# Altium schematic sheet CoverSchematic.SchDoc
size 431 x 279 mm; SheetNumber: 1; SheetTotal: 8
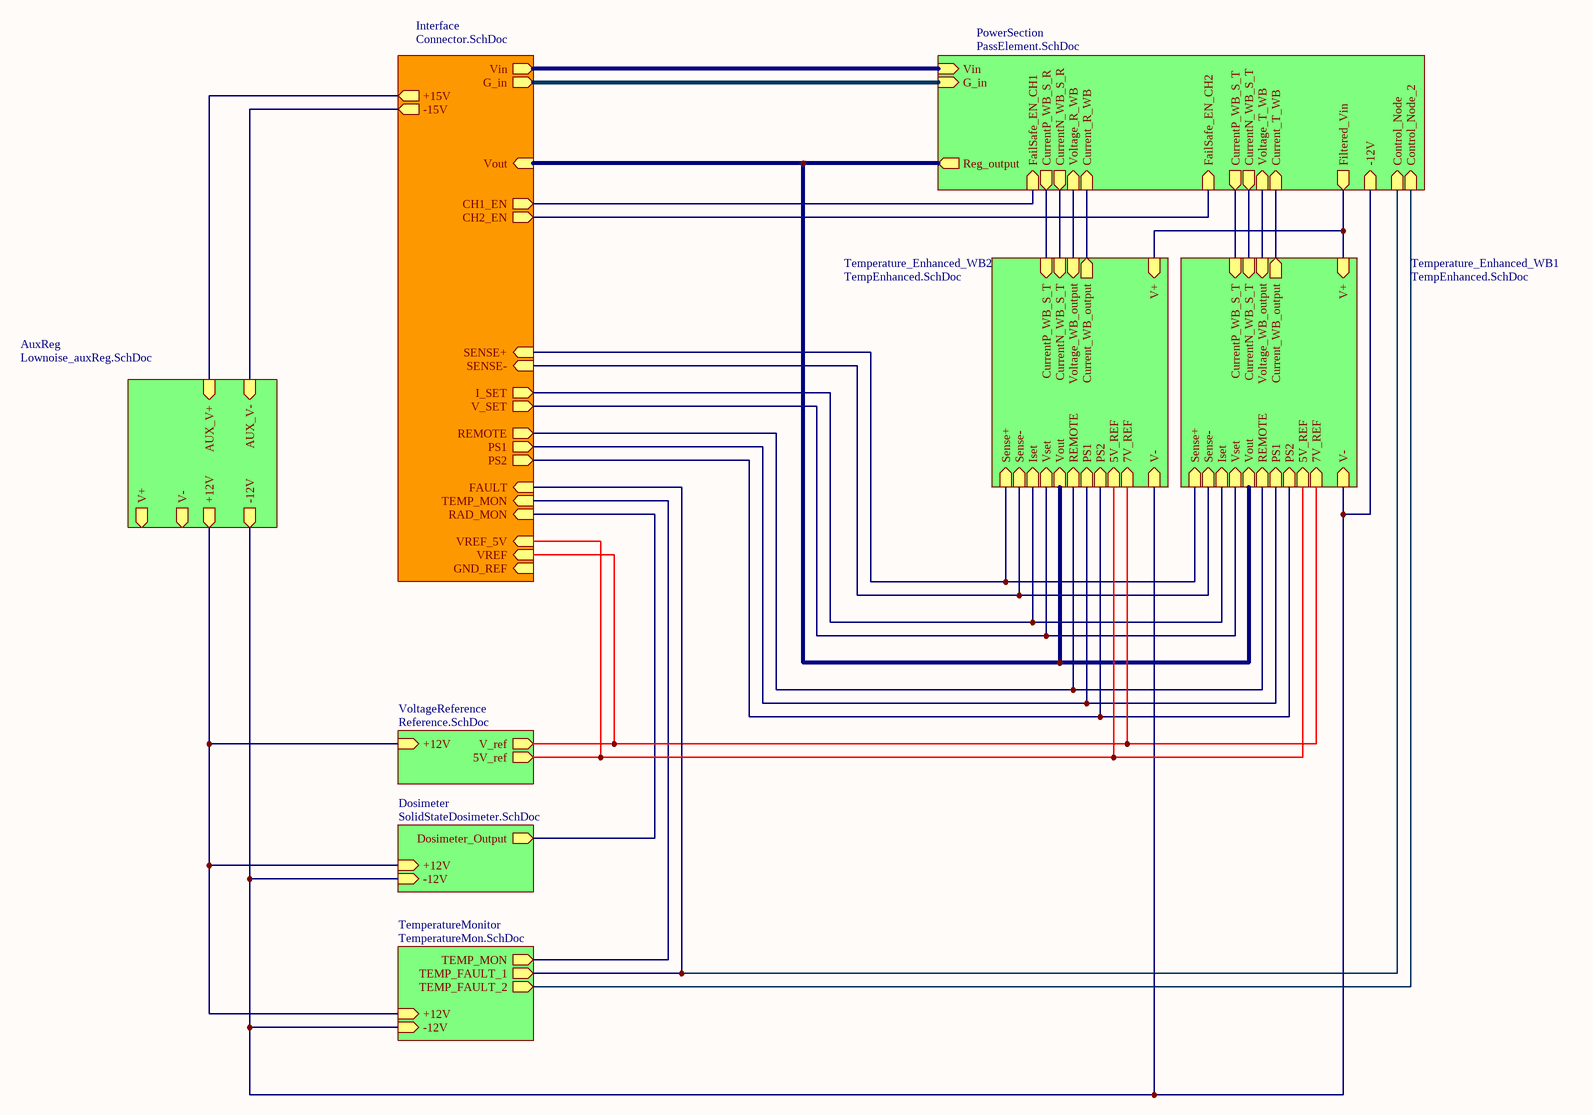
[diagram p0: CoverSchematic.SchDoc]

## Sub-sheets
AuxReg = Lownoise_auxReg.SchDoc: AUX_V+ (in), AUX_V- (in), +12V (out), -12V (out), V+ (out), V- (out)
Dosimeter = SolidStateDosimeter.SchDoc: Dosimeter_Output (out), -12V (in), +12V (in)
Interface = Connector.SchDoc: Vin (out), +15V (out), -15V (out), SENSE- (in), SENSE+ (in), Vout (in), V_SET (out), I_SET (out), CH1_EN (out), CH2_EN (out), FAULT (in), RAD_MON (in), TEMP_MON (in), VREF_5V (in), GND_REF (in), VREF (in), PS2 (out), REMOTE (out), PS1 (out), G_in (out)
PowerSection = PassElement.SchDoc: Vin (in), Reg_output (out), -12V (in), FailSafe_EN_CH1 (in), CurrentP_WB_S_R (out), CurrentN_WB_S_R (out), Voltage_R_WB (in), Current_R_WB (in), FailSafe_EN_CH2 (in), CurrentP_WB_S_T (out), CurrentN_WB_S_T (out), Voltage_T_WB (in), Current_T_WB (in), Filtered_Vin (out), Control_Node (in), Control_Node_2 (in), G_in (in)
Temperature_Enhanced_WB1 = TempEnhanced.SchDoc: V+ (in), V- (in), Voltage_WB_output (in), Current_WB_output (out), CurrentP_WB_S_T (in), CurrentN_WB_S_T (in), Sense+ (in), Sense- (in), Iset (in), Vset (in), 5V_REF (in), 7V_REF (in), Vout (in), REMOTE (in), PS1 (in), PS2 (in)
Temperature_Enhanced_WB2 = TempEnhanced.SchDoc: V+ (in), V- (in), Voltage_WB_output (in), Current_WB_output (out), CurrentP_WB_S_T (in), CurrentN_WB_S_T (in), Sense+ (in), Sense- (in), Iset (in), Vset (in), 5V_REF (in), 7V_REF (in), Vout (in), REMOTE (in), PS1 (in), PS2 (in)
TemperatureMonitor = TemperatureMon.SchDoc: -12V (in), +12V (in), TEMP_FAULT_1 (out), TEMP_MON (out), TEMP_FAULT_2 (out)
VoltageReference = Reference.SchDoc: V_ref (out), 5V_ref (out), +12V (in)

## Nets
(unnamed): sheet Interface/Vin, sheet PowerSection/Vin
(unnamed): sheet Interface/+15V, sheet AuxReg/AUX_V+
(unnamed): sheet Interface/-15V, sheet AuxReg/AUX_V-
(unnamed): sheet Interface/SENSE-, sheet Temperature_Enhanced_WB1/Sense-, sheet Temperature_Enhanced_WB2/Sense-
(unnamed): sheet Interface/SENSE+, sheet Temperature_Enhanced_WB1/Sense+, sheet Temperature_Enhanced_WB2/Sense+
(unnamed): sheet Interface/Vout, sheet PowerSection/Reg_output, sheet Temperature_Enhanced_WB1/Vout, sheet Temperature_Enhanced_WB2/Vout
(unnamed): sheet Interface/V_SET, sheet Temperature_Enhanced_WB1/Vset, sheet Temperature_Enhanced_WB2/Vset
(unnamed): sheet Interface/I_SET, sheet Temperature_Enhanced_WB1/Iset, sheet Temperature_Enhanced_WB2/Iset
(unnamed): sheet Interface/CH1_EN, sheet PowerSection/FailSafe_EN_CH1
(unnamed): sheet Interface/CH2_EN, sheet PowerSection/FailSafe_EN_CH2
(unnamed): sheet Interface/FAULT, sheet PowerSection/Control_Node, sheet TemperatureMonitor/TEMP_FAULT_1
(unnamed): sheet Interface/RAD_MON, sheet Dosimeter/Dosimeter_Output
(unnamed): sheet Interface/TEMP_MON, sheet TemperatureMonitor/TEMP_MON
(unnamed): sheet Interface/VREF_5V, sheet VoltageReference/5V_ref, sheet Temperature_Enhanced_WB1/5V_REF, sheet Temperature_Enhanced_WB2/5V_REF
(unnamed): sheet Interface/VREF, sheet VoltageReference/V_ref, sheet Temperature_Enhanced_WB1/7V_REF, sheet Temperature_Enhanced_WB2/7V_REF
(unnamed): sheet Interface/PS2, sheet Temperature_Enhanced_WB1/PS2, sheet Temperature_Enhanced_WB2/PS2
(unnamed): sheet Interface/REMOTE, sheet Temperature_Enhanced_WB1/REMOTE, sheet Temperature_Enhanced_WB2/REMOTE
(unnamed): sheet Interface/PS1, sheet Temperature_Enhanced_WB1/PS1, sheet Temperature_Enhanced_WB2/PS1
(unnamed): sheet Interface/G_in, sheet PowerSection/G_in
(unnamed): sheet PowerSection/-12V, sheet Temperature_Enhanced_WB1/V-, sheet Dosimeter/-12V, sheet TemperatureMonitor/-12V, sheet AuxReg/-12V, sheet Temperature_Enhanced_WB2/V-
(unnamed): sheet PowerSection/CurrentP_WB_S_R, sheet Temperature_Enhanced_WB2/CurrentP_WB_S_T
(unnamed): sheet PowerSection/CurrentN_WB_S_R, sheet Temperature_Enhanced_WB2/CurrentN_WB_S_T
(unnamed): sheet PowerSection/Voltage_R_WB, sheet Temperature_Enhanced_WB2/Voltage_WB_output
(unnamed): sheet PowerSection/Current_R_WB, sheet Temperature_Enhanced_WB2/Current_WB_output
(unnamed): sheet PowerSection/CurrentP_WB_S_T, sheet Temperature_Enhanced_WB1/CurrentP_WB_S_T
(unnamed): sheet PowerSection/CurrentN_WB_S_T, sheet Temperature_Enhanced_WB1/CurrentN_WB_S_T
(unnamed): sheet PowerSection/Voltage_T_WB, sheet Temperature_Enhanced_WB1/Voltage_WB_output
(unnamed): sheet PowerSection/Current_T_WB, sheet Temperature_Enhanced_WB1/Current_WB_output
(unnamed): sheet PowerSection/Filtered_Vin, sheet Temperature_Enhanced_WB1/V+, sheet Temperature_Enhanced_WB2/V+
(unnamed): sheet PowerSection/Control_Node_2, sheet TemperatureMonitor/TEMP_FAULT_2
(unnamed): sheet VoltageReference/+12V, sheet Dosimeter/+12V, sheet TemperatureMonitor/+12V, sheet AuxReg/+12V

## Notes on the sheet
- DWG. NO.
- REV.
- SHT.
- THIS DOCUMENT AND THE DATA DISCLOSED HEREIN OR HEREWITH IS THE PROPERTY OF ALTIUM LIMITED AND MAY BE FREELY DISTRIBUTED IN WHOLE. NO RIGHTS ARE RESERVED OR EXPRESS OR IMPLIED WARANTEE GIVEN.
- REVISION
- DESCRIPTION
- DATE
- APPROVED
- TITLE
- PROJECT
- SCALE:
- B
- SIZE
- CAGE CODE
- FILE NAME
- DWG by:
- Heitor Sampaio Mendes
- SHEET
- OF
- REV